# EAGLE design Batboard rev 2.2 (EAGLE 9.0.1)

## Sheet 1 of 4
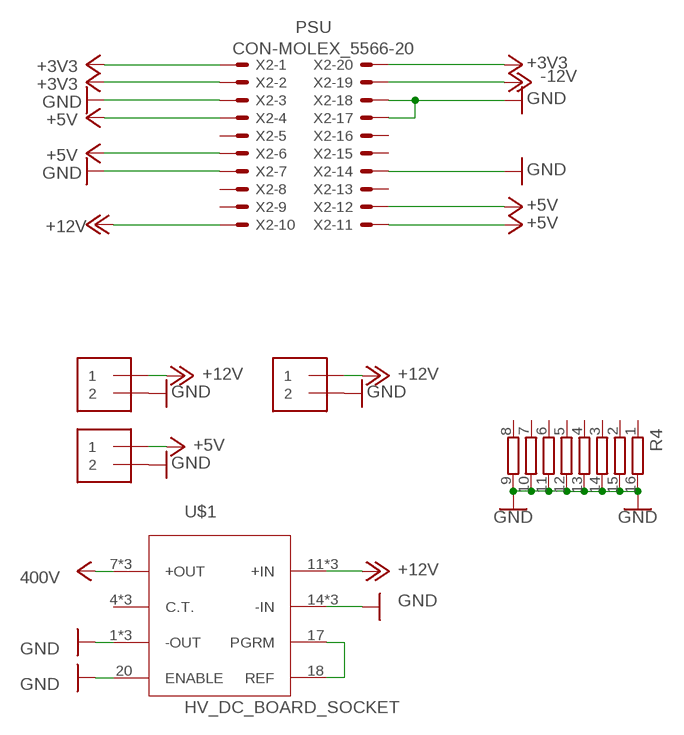
[diagram p0: schematic, sheet 1]

### Parts
J1  1X2-3.5MM  [1X2-3.5MM]
J4  1X2-3.5MM  [1X2-3.5MM]
J6  1X2-3.5MM  [1X2-3.5MM]
R4  4816P-T01  [4816P]
U$1  HV_DC_BOARD_SOCKET  [HV-DC_BOARD_SOCKET]
X2  CON-MOLEX_5566-20  [CON-MOLEX_5566-20]

### Nets
+3V3: X2.1 X2.2 X2.20
+5V: J6.1 X2.4 X2.6 X2.11 X2.12
+12V: J1.1 J4.1 U$1.11(+IN) U$1.12(+IN) U$1.13(+IN) X2.10 ; also sheet 2,4
-12V: X2.19 ; also sheet 2
GND: J1.2 J4.2 J6.2 R4.9 R4.10 R4.11 R4.12 R4.13 R4.14 R4.15 R4.16 U$1.1(-OUT) U$1.2(-OUT) U$1.3(-OUT) U$1.14(-IN) U$1.15(-IN) U$1.16(-IN) U$1.20(ENABLE) X2.3 X2.7 X2.14 X2.17 X2.18 ; also sheet 2,4
N$1: U$1.17(PGRM) U$1.18(REF)
V+: U$1.7(+OUT) U$1.8(+OUT) U$1.9(+OUT) ; supply symbol labelled 400V ; also sheet 2
Unconnected: R4.1 R4.2 R4.3 R4.4 R4.5 R4.6 R4.7 R4.8 U$1.4(C.T.) U$1.5(C.T.) U$1.6(C.T.) X2.5 X2.8 X2.9 X2.13 X2.15 X2.16

### Notes on the sheet
- PSU

## Sheet 2 of 4
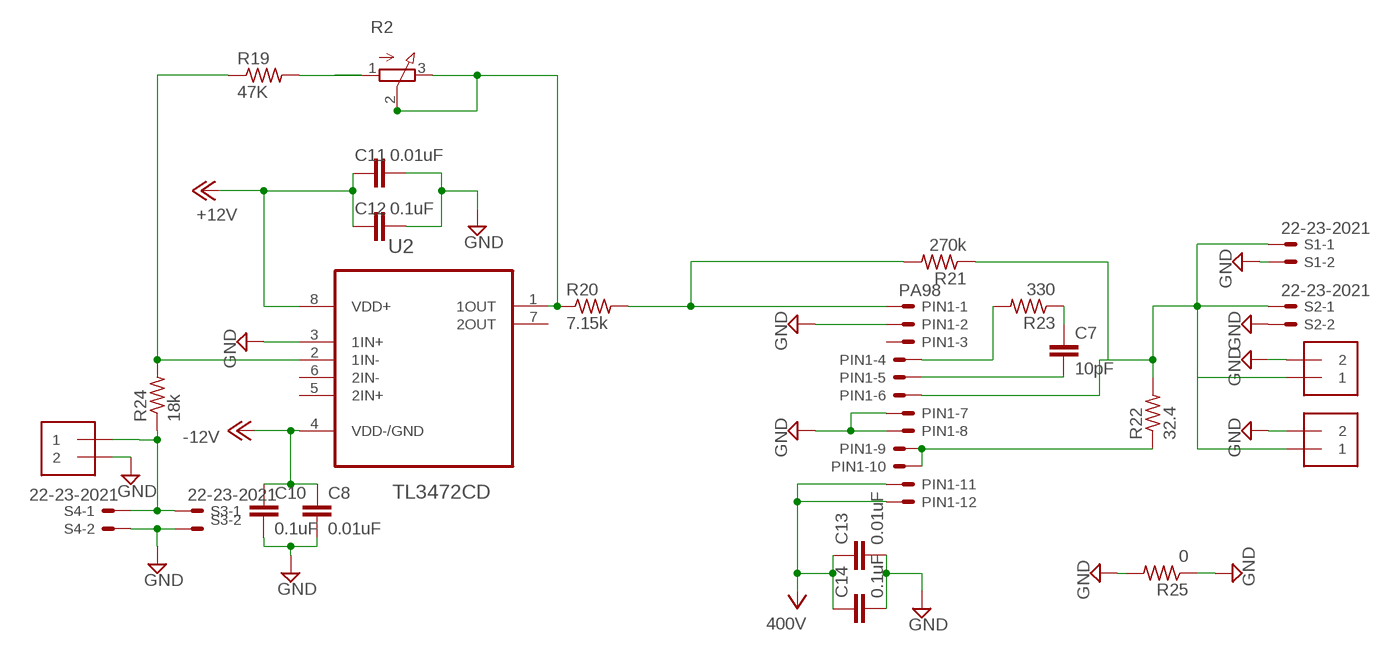
[diagram p1: schematic, sheet 2]

### Parts
C7  10pF  1.0UF-1206-50V-10%  [1206]
C8  0.01uF  1.0UF-1206-50V-10%  [1206]
C10  0.1uF  1.0UF-1206-50V-10%  [1206]
C11  0.01uF  1.0UF-1206-50V-10%  [1206]
C12  0.1uF  1.0UF-1206-50V-10%  [1206]
C13  0.01uF  1.0UF-1206-50V-10%  [1206]
C14  0.1uF  1.0UF-1206-50V-10%  [1206]
J2  1X2-3.5MM  [1X2-3.5MM]
J3  1X2-3.5MM  [1X2-3.5MM]
J5  1X2-3.5MM  [1X2-3.5MM]
PIN1  PA98  22-23-2121  [22-23-2121]
R2  3RP/1610N  [3RP/1610N]
R19  47K  R-US_M1206  [M1206]
R20  7.15k  R-US_M1206  [M1206]
R21  270k  R-US_M1206  [M1206]
R22  32.4  R-US_M1206  [M1206]
R23  330  R-US_M1206  [M1206]
R24  18k  R-US_M1206  [M1206]
R25  0  R-US_M1206  [M1206]
S1  22-23-2021  [22-23-2021]
S2  22-23-2021  [22-23-2021]
S3  22-23-2021  [22-23-2021]
S4  22-23-2021  [22-23-2021]
U2  TL3472CD  [SOIC127P600X175-8N]

### Nets
+12V: C11.1 C12.1 U2.8(VDD+) ; also sheet 1,4
-12V: C8.1 C10.1 U2.4(VDD-/GND) ; also sheet 1
GND: C8.2 C10.2 C11.2 C12.2 C13.2 C14.2 J2.2 J3.2 J5.2 PIN1.2 PIN1.7 PIN1.8 R25.1 R25.2 S1.2 S2.2 S3.2 S4.2 U2.3(1IN+) ; also sheet 1,4
N$4: J5.1 R24.1 S3.1 S4.1
N$10: R19.1 R24.2 U2.2(1IN-)
N$15: R2.2(S) R2.3(E) R20.1 U2.1(1OUT)
N$17: PIN1.1 R20.2 R21.2
N$20: PIN1.9 PIN1.10 R22.1
N$21: PIN1.4 R23.2
N$22: J2.1 J3.1 PIN1.6 R21.1 R22.2 S1.1 S2.1
N$24: R2.1(A) R19.2
N$25: C7.2 PIN1.5
N$26: C7.1 R23.1
V+: C13.1 C14.1 PIN1.11 PIN1.12 ; supply symbol labelled 400V ; also sheet 1
Unconnected: PIN1.3 U2.5(2IN+) U2.6(2IN-) U2.7(2OUT)

## Sheet 3 of 4
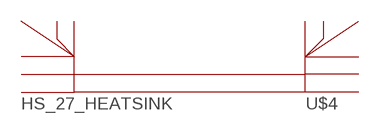
[diagram p2: schematic, sheet 3]

### Parts
U$4  HS_27_HEATSINK  [HS_27_HEATSINK]

## Sheet 4 of 4
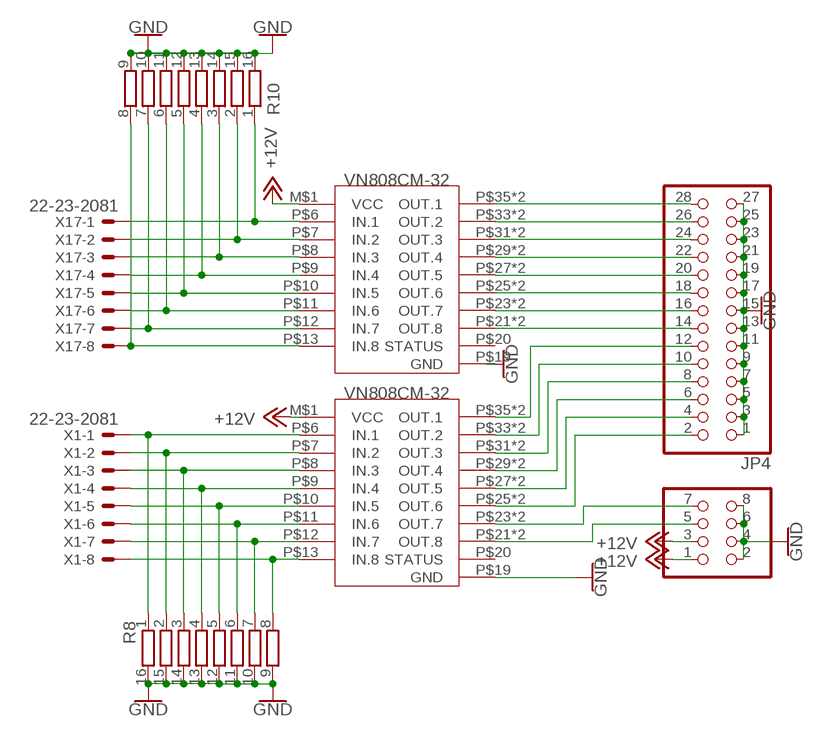
[diagram p3: schematic, sheet 4]

### Parts
JP3  PINHD-2X4  [2X04]
JP4  PINHD-2X14-CB  [2X14-CLEANBIG]
R8  4816P-T01  [4816P]
R10  4816P-T01  [4816P]
U$2  VN808CM-32-E  [PSO36]
U$3  VN808CM-32-E  [PSO36]
X1  22-23-2081  [22-23-2081]
X17  22-23-2081  [22-23-2081]

### Nets
+12V: JP3.1 JP3.3 U$2.M$1(VCC) U$3.M$1(VCC) ; also sheet 1,2
GND: JP3.2 JP3.4 JP3.6 JP3.8 JP4.1 JP4.3 JP4.5 JP4.7 JP4.9 JP4.11 JP4.13 JP4.15 JP4.17 JP4.19 JP4.21 JP4.23 JP4.25 JP4.27 R8.9 R8.10 R8.11 R8.12 R8.13 R8.14 R8.15 R8.16 R10.9 R10.10 R10.11 R10.12 R10.13 R10.14 R10.15 R10.16 U$2.P$19(GND) U$3.P$19(GND) ; also sheet 1,2
N$2: R10.1 U$2.P$6(IN.1) X17.1
N$3: R10.2 U$2.P$7(IN.2) X17.2
N$5: JP4.28 U$2.P$35(OUT.1) U$2.P$36(OUT.1)
N$6: JP4.26 U$2.P$33(OUT.2) U$2.P$34(OUT.2)
N$7: JP4.24 U$2.P$31(OUT.3) U$2.P$32(OUT.3)
N$8: JP4.22 U$2.P$29(OUT.4) U$2.P$30(OUT.4)
N$9: JP4.20 U$2.P$27(OUT.5) U$2.P$28(OUT.5)
N$11: JP4.18 U$2.P$25(OUT.6) U$2.P$26(OUT.6)
N$12: JP4.16 U$2.P$23(OUT.7) U$2.P$24(OUT.7)
N$13: JP4.14 U$2.P$21(OUT.8) U$2.P$22(OUT.8)
N$14: JP4.12 U$3.P$35(OUT.1) U$3.P$36(OUT.1)
N$16: JP4.10 U$3.P$33(OUT.2) U$3.P$34(OUT.2)
N$18: JP4.8 U$3.P$31(OUT.3) U$3.P$32(OUT.3)
N$19: JP4.6 U$3.P$29(OUT.4) U$3.P$30(OUT.4)
N$23: JP4.4 U$3.P$27(OUT.5) U$3.P$28(OUT.5)
N$27: JP4.2 U$3.P$25(OUT.6) U$3.P$26(OUT.6)
N$28: JP3.7 U$3.P$23(OUT.7) U$3.P$24(OUT.7)
N$29: JP3.5 U$3.P$21(OUT.8) U$3.P$22(OUT.8)
N$30: R8.1 U$3.P$6(IN.1) X1.1
N$32: R10.8 U$2.P$13(IN.8) X17.8
N$33: R10.7 U$2.P$12(IN.7) X17.7
N$35: R10.3 U$2.P$8(IN.3) X17.3
N$36: R10.6 U$2.P$11(IN.6) X17.6
N$37: R10.5 U$2.P$10(IN.5) X17.5
N$38: R10.4 U$2.P$9(IN.4) X17.4
N$39: R8.8 U$3.P$13(IN.8) X1.8
N$40: R8.7 U$3.P$12(IN.7) X1.7
N$41: R8.2 U$3.P$7(IN.2) X1.2
N$42: R8.3 U$3.P$8(IN.3) X1.3
N$43: R8.6 U$3.P$11(IN.6) X1.6
N$44: R8.5 U$3.P$10(IN.5) X1.5
N$45: R8.4 U$3.P$9(IN.4) X1.4
Unconnected: U$2.P$20(STATUS) U$3.P$20(STATUS)

## Library data of the parts
C7 = SparkFun-Capacitors:1.0UF: 1µF ceramic capacitors A capacitor is a passive two-terminal electrical component used to store electrical energy temporarily in an electric field.; MF: KEMET; MPN: C0805C479C5GACTU; OC_FARNELL: 1800809; PROD_ID: CAP-09822; VALUE: 1.0uF
C8 C11 C13 = SparkFun-Capacitors:1.0UF: 1µF ceramic capacitors A capacitor is a passive two-terminal electrical component used to store electrical energy temporarily in an electric field.; MF: KEMET; MPN: C0805C103K1RACTU; OC_FARNELL: 1414661; PROD_ID: CAP-09822; VALUE: 1.0uF
C10 C12 C14 = SparkFun-Capacitors:1.0UF: 1µF ceramic capacitors A capacitor is a passive two-terminal electrical component used to store electrical energy temporarily in an electric field.; MF: KEMET; MPN: C0805C104J5RACTU; OC_FARNELL: 1414663; PROD_ID: CAP-09822; VALUE: 1.0uF
J1-J6 = adafruit:1X2: 3.5mm Terminal block http://www.ladyada.net/library/pcb/eaglelibrary.html
JP3 = adafruit:PINHD-2X4: PIN HEADER
JP4 = adafruit:PINHD-2X14: PIN HEADER
PIN1 = con-molex:22-23-2121: .100" (2.54mm) Center Header - 12 Pin; OC_FARNELL: unknown; OC_NEWARK: 56H0456
R2 = pot:3RP/1610N: 16mm Potentiometer one level Source: http://www.alphapotentiometers.net/html/16mm_pot_2.html
R4 R8 R10 = resistor-bourns:4816P-T01: BOURNS RESISTOR NETWORK; MF: BOURNS, INC.; MPN: 4816P-T01-684LF; OC_FARNELL: 9357483; OC_NEWARK: 33K0707
R19 = adafruit:R-US_: RESISTOR, American symbol; MF: KOA SPEAR ELECTRONICS; MPN: SG73S2ATTD9102F; OC_FARNELL: 1400374
R20 = adafruit:R-US_: RESISTOR, American symbol; MF: VISHAY; MPN: CRCW08057K15FKEA; OC_FARNELL: 1152455
R21 = adafruit:R-US_: RESISTOR, American symbol; MF: WELWYN; MPN: WCR0805-270KFI; OC_FARNELL: 1100330RL
R22 R23 R25 = adafruit:R-US_: RESISTOR, American symbol; MF: PANASONIC ELECTRONIC COMPONENTS; MPN: ERJ8ENF32R4V; OC_FARNELL: 2307627
R24 = adafruit:R-US_: RESISTOR, American symbol; MF: WELWYN; MPN: WCR0805-18KFI; OC_FARNELL: 1100322
S1-S4 = con-molex:22-23-2021: .100" (2.54mm) Center Header - 2 Pin; MF: MOLEX; MPN: 22-23-2021; OC_FARNELL: 1462926; OC_NEWARK: 25C3832
U2 = TL3472CD:TL3472CD: HIGH-SLEW-RATE, SINGLE-SUPPLY OPERATIONAL AMPLIFIER; AVAILABILITY: Good; DESCRIPTION: High-Slew- ate, Single-Supply Operational Amplifier 8-SOIC 0 to 70; MF: Texas Instruments; MP: TL3472CD; OC_FARNELL: unknown; PACKAGE: SOIC-8 Texas Instruments; PRICE: 0.47 USD
U$1 = ultravolt_daughterboard:HV_DC_BOARD_SOCKET
U$2 U$3 = powersupplybatbot:VN808CM-32-E
U$4 = ultravolt_daughterboard:HS_27_HEATSINK
X1 X17 = con-molex:22-23-2081: .100" (2.54mm) Center Header - 8 Pin; MF: MOLEX; MPN: 22-23-2081; OC_FARNELL: 1756826; OC_NEWARK: 01C7592
X2 = molex:CON-MOLEX_5566-20: Mini FIT connector 20 pol ATX PC-Motherboard Power connector Source: http://www.molex.com; OC_FARNELL: unknown; OC_NEWARK: unknown

## Board
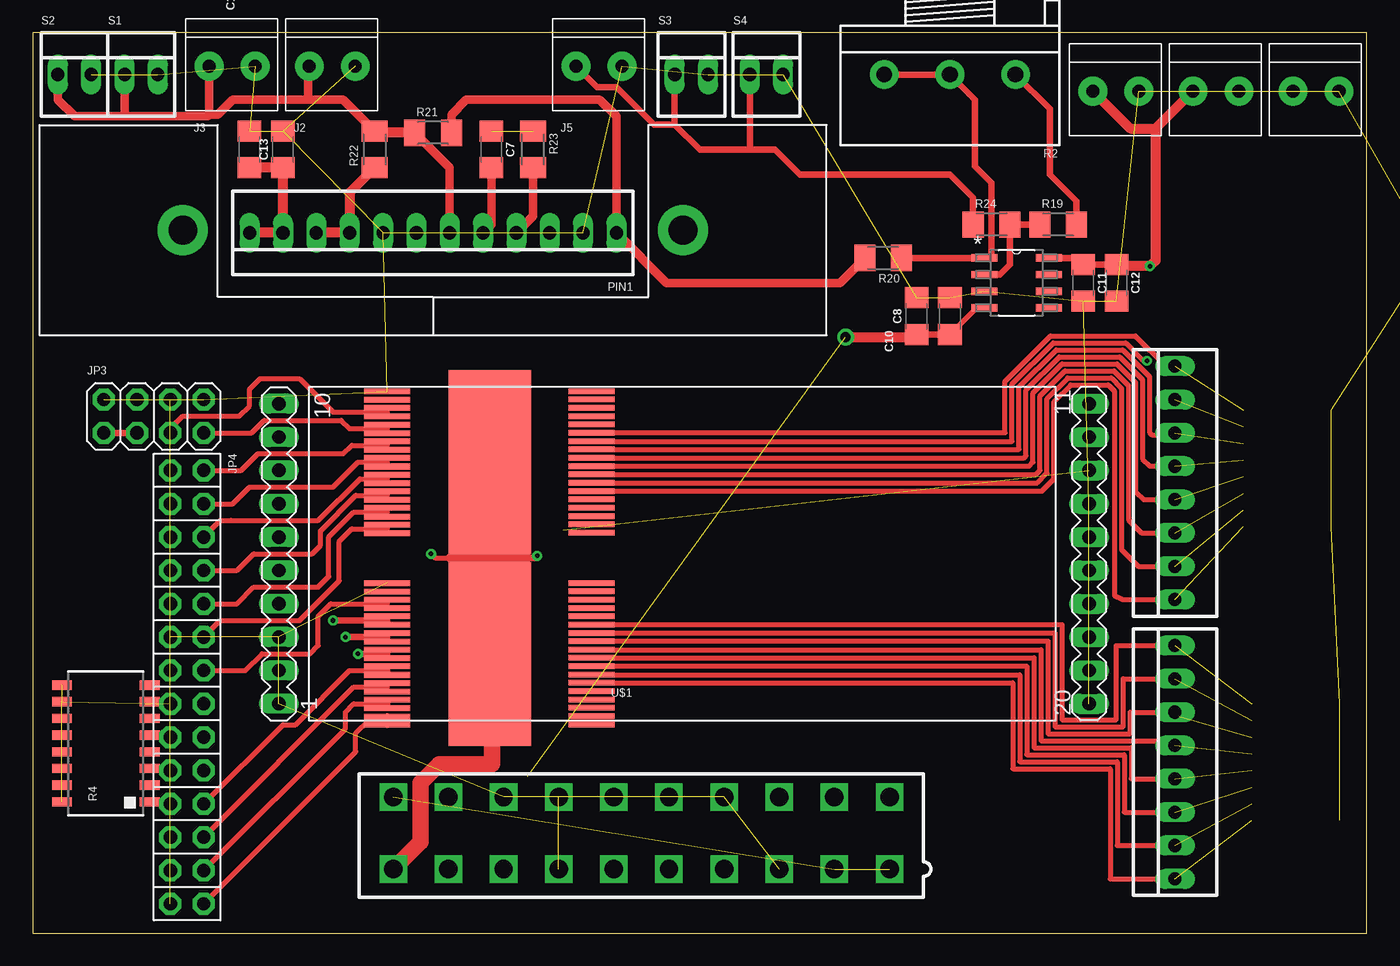
[diagram p4: board, top side]
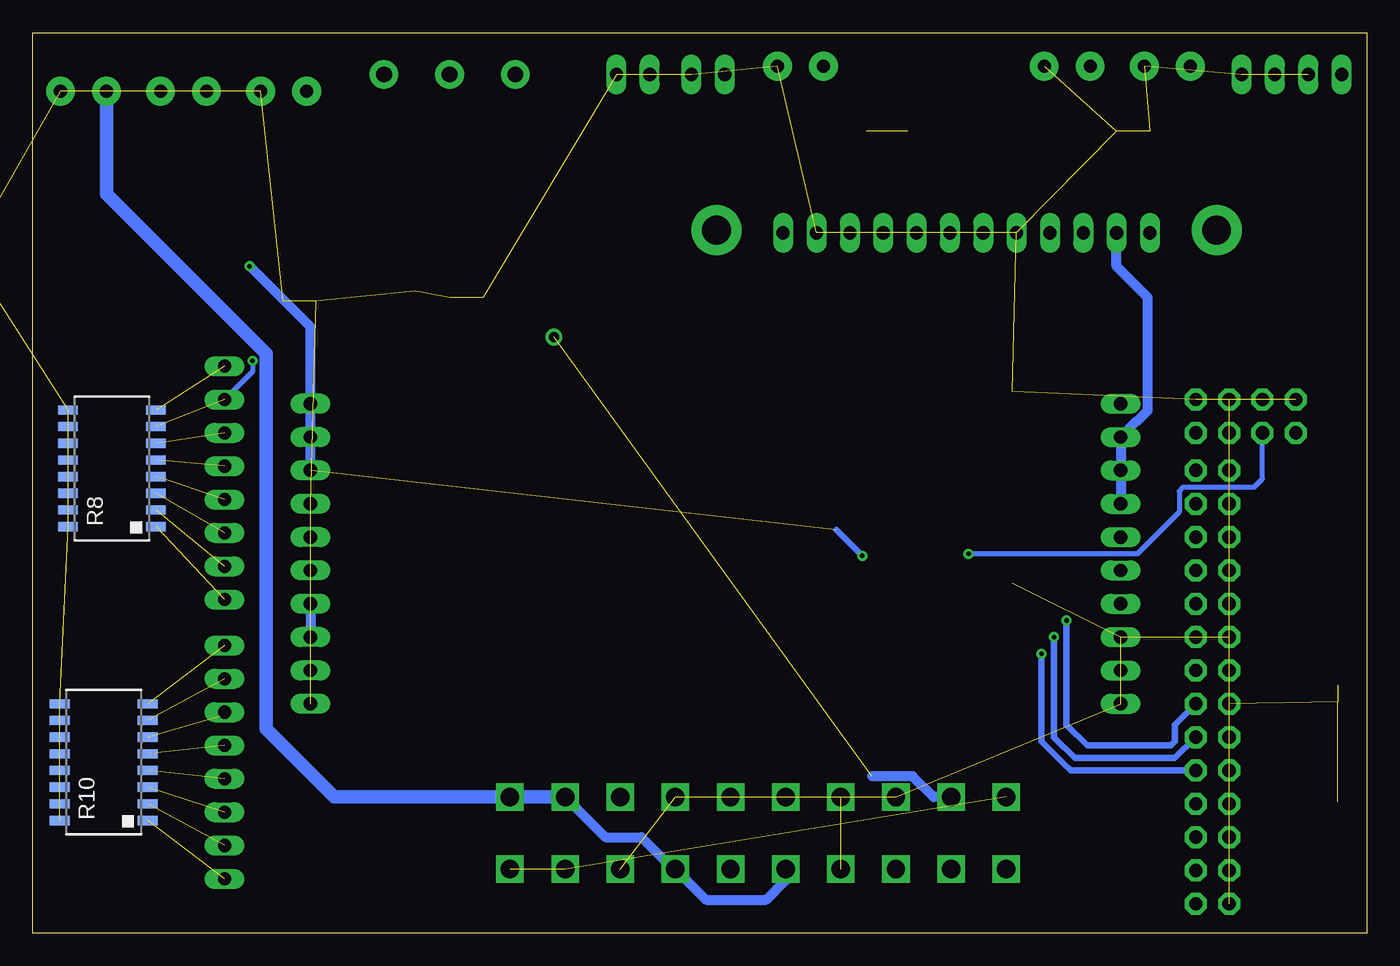
[diagram p5: board, bottom side, seen from below]

Size 101.6 x 68.58 mm. Coordinates in mm from the lower left corner, seen from the top.
Outline: 0,0 101.6,0 101.6,68.58 0,68.58 0,0
Copper layers (1*16): Top 0.035mm / dielectric 1.5mm / Bottom 0.035mm
Design rules "default": minimum track width 6mil, minimum drill 0.35mm, track to track 6mil, track to pad 6mil, pad to pad 6mil, via to via 6mil, smd to smd 6mil, copper to edge 40mil, drill to drill 6mil, minimum pad ring 10mil, minimum via ring 8mil, stop-mask expansion 4mil, vias tented up to drill 0mil, thermal gap 10mil

### Footprints (pad centres in the part's own frame; a part is rotated, then mirrored left to right if it is on the bottom)
1206 = smd 1.6 x 1.8: 1 -1.4,0; 2 1.4,0
1X2-3.5MM = drill 1 pad 2.184: 1 1.8,0; 2 -1.7,0
2X04 = drill 1.016 pad 1.676 octagon: 1 -3.81,-1.27; 2 -3.81,1.27; 3 -1.27,-1.27; 4 -1.27,1.27; 5 1.27,-1.27; 6 1.27,1.27; 7 3.81,-1.27; 8 3.81,1.27
2X14-CLEANBIG = drill 1.016 pad 1.676 octagon: 1 -16.51,-1.27; 2 -16.51,1.27; 3 -13.97,-1.27; 4 -13.97,1.27; 5 -11.43,-1.27; 6 -11.43,1.27; 7 -8.89,-1.27; 8 -8.89,1.27; 9 -6.35,-1.27; 10 -6.35,1.27; 11 -3.81,-1.27; 12 -3.81,1.27; 13 -1.27,-1.27; 14 -1.27,1.27; 15 1.27,-1.27; 16 1.27,1.27; 17 3.81,-1.27; 18 3.81,1.27; 19 6.35,-1.27; 20 6.35,1.27; 21 8.89,-1.27; 22 8.89,1.27; 23 11.43,-1.27; 24 11.43,1.27; 25 13.97,-1.27; 26 13.97,1.27; 27 16.51,-1.27; 28 16.51,1.27
22-23-2121 = drill 1 long: 1 -13.97,0; 2 -11.43,0; 3 -8.89,0; 4 -6.35,0; 5 -3.81,0; 6 -1.27,0; 7 1.27,0; 8 3.81,0; 9 6.35,0; 10 8.89,0; 11 11.43,0; 12 13.97,0
3RP/1610N = drill 1.2 pad 2.184: 1 -5,0; 2 0,0; 3 5,0
4816P = smd 0.7 x 1.5: 1 -4.445,-3.346; 2 -3.175,-3.346; 3 -1.905,-3.346; 4 -0.635,-3.346; 5 0.635,-3.346; 6 1.905,-3.346; 7 3.175,-3.346; 8 4.445,-3.346; 9 4.445,3.346; 10 3.175,3.346; 11 1.905,3.346; 12 0.635,3.346; 13 -0.635,3.346; 14 -1.905,3.346; 15 -3.175,3.346; 16 -4.445,3.346
M1206 = smd 1.6 x 2: 1 -1.4,0; 2 1.4,0
22-23-2021 = drill 1 long: 1 -1.27,0; 2 1.27,0
SOIC127P600X175-8N = smd 1.981 x 0.559: 1 -2.464,1.905; 2 -2.464,0.635; 3 -2.464,-0.635; 4 -2.464,-1.905; 5 2.464,-1.905; 6 2.464,-0.635; 7 2.464,0.635; 8 2.464,1.905
HV-DC_BOARD_SOCKET = drill 1.016 long: 1 -11.43,-13.97; 2 -11.43,-11.43; 3 -11.43,-8.89; 4 -11.43,-6.35; 5 -11.43,-3.81; 6 -11.43,-1.27; 7 -11.43,1.27; 8 -11.43,3.81; 9 -11.43,6.35; 10 -11.43,8.89; 11 50.292,8.89; 12 50.292,6.35; 13 50.292,3.81; 14 50.292,1.27; 15 50.292,-1.27; 16 50.292,-3.81; 17 50.292,-6.35; 18 50.292,-8.89; 19 50.292,-11.43; 20 50.292,-13.97
PSO36 = smd 14 x 6.3: M$1 0.317,0.117 | smd 0.42 x 3.5: P$1 -5.08,-7.618; P$2 -4.43,-7.618; P$3 -3.796,-7.618; P$4 -3.176,-7.618; P$5 -2.526,-7.618; P$6 -1.892,-7.618; P$7 -1.272,-7.618; P$8 -0.622,-7.618; P$9 0.012,-7.618; P$10 0.632,-7.618; P$11 1.282,-7.618; P$12 1.902,-7.618; P$13 2.552,-7.618; P$14 3.186,-7.618; P$15 3.806,-7.618; P$16 4.456,-7.618; P$17 5.09,-7.618; P$18 5.71,-7.618; P$19 5.71,7.931; P$20 5.06,7.931; P$21 4.44,7.931; P$22 3.79,7.931; P$23 3.17,7.931; P$24 2.52,7.931; P$25 1.9,7.931; P$26 1.25,7.931; P$27 0.63,7.931; P$28 -0.02,7.931; P$29 -0.64,7.931; P$30 -1.29,7.931; P$31 -1.91,7.931; P$32 -2.56,7.931; P$33 -3.178,7.931; P$34 -3.828,7.931; P$35 -4.462,7.931; P$36 -5.096,7.931
HS_27_HEATSINK = drill 2.184 pad 3.81: 1 -19.05,6.553; 2 19.05,6.553
22-23-2081 = drill 1 long: 1 -8.89,0; 2 -6.35,0; 3 -3.81,0; 4 -1.27,0; 5 1.27,0; 6 3.81,0; 7 6.35,0; 8 8.89,0
CON-MOLEX_5566-20 = drill 1.4 square: 1 18.9,-2.75; 2 14.7,-2.75; 3 10.5,-2.75; 4 6.3,-2.75; 5 2.1,-2.75; 6 -2.1,-2.75; 7 -6.3,-2.75; 8 -10.5,-2.75; 9 -14.7,-2.75; 10 -18.9,-2.75; 11 18.9,2.75; 12 14.7,2.75; 13 10.5,2.75; 14 6.3,2.75; 15 2.1,2.75; 16 -2.1,2.75; 17 -6.3,2.75; 18 -10.5,2.75; 19 -14.7,2.75; 20 -18.9,2.75

### Placement (x,y rotation side)
C7  34.92,59.69 270 top
C8  67.31,46.99 90 top
C10  69.85,46.99 90 top
C11  80.01,49.53 270 top
C12  82.55,49.53 270 top
C13  19.05,59.69 90 top
C14  16.51,59.69 90 top
J1  90.17,64.14 180 top
J2  22.86,66.04 180 top
J3  15.24,66.04 180 top
J4  82.55,64.14 180 top
J5  43.18,66.04 180 top
J6  97.79,64.14 180 top
JP3  9.21,39.37 0 top
JP4  11.75,18.73 270 top
PIN1  30.48,53.34 180 top
R2  69.85,65.41 180 top
R4  5.56,14.45 90 top
R8  95.57,35.4 90 bottom
R10  96.2,13.02 90 bottom
R19  78.11,53.98 0 top
R20  64.77,51.44 180 top
R21  30.48,60.96 0 top
R22  26.04,59.69 90 top
R23  38.1,59.69 270 top
R24  73.03,53.98 0 top
R25  107.95,51.75 180 top  (outside the outline)
S1  8.26,65.41 0 top
S2  3.17,65.41 0 top
S3  50.16,65.41 0 top
S4  55.88,65.41 0 top
U2  74.93,49.53 0 top
U$1  30.16,31.43 0 top
U$2  34.92,20.95 90 top
U$3  34.92,35.56 90 top
U$4  30.48,46.99 0 top
X1  87,34.29 90 top
X2  46.35,7.62 0 top
X17  87,13.02 90 top

### Tracks (layer width: path | path; a pad name or v marks a point on that pad's centre or on a via)
+3V3  (2 unrouted)
+5V
  Bottom 0.762: X2.12 57.99,7.3 55.24,7.3 52.81,4.87 X2.4 50.33,2.54 45.72,2.54 44.26,4 X2.6
  Bottom 1.016: X2.12 X2.11 78.63,10.37 83.82,15.56 83.82,44.13 95.99,56.3 J6.1
+12V  (via drill 0.35)  (1 unrouted)
  Top 0.381: v30.32,28.89 30.64,28.57 31.75,28.57
  Top 0.508: U2.8 79.5,51.44 C11.1 C12.1 | JP3.3 JP3.1 | 37.62,28.57 38.26,28.57 v38.42,28.73
  Top 0.635: 31.75,28.57 34.81,28.57
  Top 0.762: C12.1 82.68,50.8 v85.09,50.8 85.51,51.22 85.51,61.28 | 34.81,28.57 37.62,28.57 | J4.1 83.61,61.28 85.51,61.28 | 85.51,61.28 J1.1
  Top 1.27: 34.92,21.16 U$2.M$1 | 34.97,23.81 34.97,12.9 34.92,12.86 30.93,12.86 29.53,11.46 29.53,6.94 X2.10
  Top 1.778: 34.92,20.95 34.61,21.27 | 34.29,21.59 34.61,21.27 | 34.61,21.27 U$2.M$1
  Top 2.54: U$3.M$1 34.81,28.57 34.97,23.81 U$2.M$1
  Bottom 0.381: JP3.3 7.94,34.61 8.57,33.97 13.97,33.97 14.29,33.66 14.29,32.07 17.46,28.89 v30.32,28.89
  Bottom 0.508: v38.42,28.73 40.38,30.7
  Bottom 0.762: v85.09,50.8 80.45,46.16 U$1.11 U$1.12 U$1.13
-12V  (via drill 0.76 pad 1.27)  (1 unrouted)
  Top 0.381: C10.1 71.89,47.62 U2.4
  Top 0.508: C10.1 C8.1 66.88,45.16
  Top 0.762: v61.91,45.4 67.12,45.4 C8.1
  Bottom 0.762: X2.19 33,10.37 34.58,11.95 37.67,11.95
GND  (77 unrouted)
N$1
  Bottom 0.762: U$1.17 U$1.18
N$2  (1 unrouted)
  Top 0.381: U$2.P$6 74.65,19.06 74.65,12.52 82.06,12.52 82.06,4.13 X17.1
N$3  (1 unrouted)
  Top 0.381: U$2.P$7 75.18,19.68 75.18,13.06 82.59,13.06 82.59,6.67 X17.2
N$4
  Top 0.508: S3.1 48.9,61.59 | 48.9,61.59 50.8,59.69 54.61,59.69 | 54.61,59.69 56.52,59.69 58.42,57.78 69.85,57.78 71.62,56.01 R24.1 | S4.1 54.61,59.69 | J5.1 42.97,64.45 44.45,64.45 47.31,61.59 48.9,61.59
N$5
  Top 0.381: JP4.28 24.61,13.81 24.61,15.24 25.56,16.19 26.99,16.19
  Top 0.508: U$2.P$35 26.99,16.19 U$2.P$36 | JP4.28
N$6
  Top 0.254: U$2.P$34 26.99,17.46 U$2.P$33
  Top 0.381: JP4.26 23.81,15.56 23.81,16.83 24.45,17.46 26.67,17.46
  Top 0.508: 26.67,17.46 26.99,17.46
N$7
  Top 0.254: U$2.P$32 26.99,18.73 U$2.P$31
  Top 0.381: JP4.24 24.45,18.73 26.99,18.73
N$8
  Top 0.254: U$2.P$30 26.99,20 U$2.P$29
  Top 0.381: JP4.22 19.05,15.88 20,15.88 24.13,20 26.67,20
  Top 0.508: 26.67,20 26.99,20
N$9  (via drill 0.35)
  Top 0.254: U$2.P$28 26.99,21.27 U$2.P$27
  Top 0.508: v24.77,21.27 26.99,21.27
  Bottom 0.508: v24.77,21.27 24.77,14.61 23.1,12.94 22.54,12.38 JP4.20
N$10
  Top 0.508: R19.1 R24.2 74.42,50.93 73.66,50.16 U2.2
N$11  (via drill 0.35)
  Top 0.254: U$2.P$26 26.99,22.54 U$2.P$25
  Top 0.508: v23.81,22.54 26.99,22.54
  Bottom 0.508: JP4.18 14.61,13.34 22.23,13.34 23.81,14.92 v23.81,22.54
N$12  (via drill 0.35)
  Top 0.254: U$2.P$24 26.99,23.81 U$2.P$23
  Top 0.508: v22.86,23.81 26.99,23.81
  Bottom 0.508: JP4.16 14.61,15.88 14.61,14.61 14.92,14.29 21.27,14.29 22.86,15.88 v22.86,23.81
N$13
  Top 0.254: U$2.P$22 26.99,25.08 U$2.P$21
  Top 0.381: JP4.14 16.19,20 17.46,21.27 21.11,21.27 21.75,21.91 21.75,24.13 22.7,25.08 26.99,25.08
N$14
  Top 0.254: U$3.P$36 26.99,30.8 U$3.P$35
  Top 0.381: JP4.12 14.29,23.81 20.32,23.81 23.34,26.83 23.34,29.84 24.29,30.8 26.99,30.8
N$15
  Top 0.508: R20.1 U2.1 73.03,51.44 73.03,57.15 71.75,58.42 71.75,63.5 R2.2 R2.3
N$16
  Top 0.254: U$3.P$34 26.99,32.07 U$3.P$33
  Top 0.381: JP4.10 15.56,25.08 16.83,26.35 21.75,26.35 22.54,27.15 22.54,30.16 24.45,32.07 26.99,32.07
N$17
  Top 0.635: R20.2 61.47,49.53 48.26,49.53 PIN1.1 44.45,62.23 43.18,63.5 33.02,63.5 31.88,62.36 R21.2
N$18
  Top 0.254: U$3.P$32 26.99,33.34 U$3.P$31
  Top 0.381: JP4.8 15.56,27.62 16.83,28.89 21.27,28.89 21.91,29.53 21.91,30.64 24.61,33.34 26.99,33.34
N$19
  Top 0.254: U$3.P$30 26.99,34.61 U$3.P$29
  Top 0.381: JP4.6 14.29,31.43 15.08,31.43 21.75,31.43 24.92,34.61 26.99,34.61
N$20
  Top 0.762: R22.1 24.13,56.38 PIN1.9 PIN1.10
N$21
  Top 0.635: PIN1.4 38.1,54.61 R23.2
N$22
  Top 0.635: R22.2 23.62,63.5 20.95,63.5 | 20.95,63.5 15.24,63.5 14.07,62.34 13.44,62.34 | 13.44,64.67 J3.1 13.44,62.34 | S2.1 1.91,63.5 3.17,62.23 6.99,62.23 | 6.99,62.23 S1.1 | 6.99,62.23 13.34,62.23 13.44,62.34 | J2.1 20.95,65.94 20.95,63.5 | R21.1 31.75,58.29 PIN1.6
  Top 0.762: R22.2 26.16,60.96 R21.1 29.21,60.83
N$23
  Top 0.254: U$3.P$28 26.99,35.88 U$3.P$27
  Top 0.381: JP4.4 15.24,32.7 16.51,33.97 22.86,33.97 24.77,35.88 26.99,35.88
N$24
  Top 0.508: R2.1 77.47,62.78 77.47,57.78 79.5,55.75 R19.2
N$25
  Top 0.635: PIN1.5 34.92,53.98 C7.2
N$26  (1 unrouted)
N$27
  Top 0.254: U$3.P$26 26.99,37.15 U$3.P$25
  Top 0.381: JP4.2 15.88,35.24 17.14,36.51 23.65,36.51 24.29,37.15 26.99,37.15
N$28
  Top 0.254: U$3.P$24 26.99,38.42 U$3.P$23
  Top 0.381: JP3.7 16.67,38.1 17.62,39.05 23.5,39.05 24.13,38.42 26.99,38.42
N$29
  Top 0.254: U$3.P$22 26.99,39.69 U$3.P$21
  Top 0.381: JP3.5 10.48,38.42 11.43,39.37 15.72,39.37 16.51,40.16 16.51,41.43 17.3,42.23 20.32,42.23 22.86,39.69 26.99,39.69
N$30  (1 unrouted)
  Top 0.381: U$3.P$6 76.85,33.67 77.79,34.61 77.79,40.48 79.06,41.75 81.92,41.75 82.39,41.27 82.39,25.72 83.03,25.4 X1.1
N$32  (1 unrouted)
  Top 0.381: U$2.P$13 78.38,23.51 78.38,16.26 82.53,16.26 82.53,21.91 X17.8
N$33  (1 unrouted)
  Top 0.381: U$2.P$12 77.85,22.86 77.85,15.72 83.06,15.72 83.06,19.37 X17.7
N$35  (1 unrouted)
  Top 0.381: U$2.P$8 75.72,20.33 75.72,13.59 83.13,13.59 83.13,9.21 X17.3
N$36  (1 unrouted)
  Top 0.254: 87.31,16.51 X17.6
  Top 0.381: U$2.P$11 77.32,22.24 77.32,15.19 83.59,15.19 83.59,16.83 X17.6
N$37  (1 unrouted)
  Top 0.381: U$2.P$10 76.78,21.59 76.78,14.66 87,14.66 X17.5
N$38  (1 unrouted)
  Top 0.254: 86.36,11.75 X17.4
  Top 0.381: U$2.P$9 76.25,20.97 76.25,14.12 83.66,14.12 83.66,11.75 X17.4
N$39  (1 unrouted)
  Top 0.381: U$3.P$13 74.05,38.11 74.05,42.03 77.51,45.48 83.99,45.48 86.3,43.18 X1.8
N$40  (via drill 0.35)  (1 unrouted)
  Top 0.381: U$3.P$12 74.59,37.46 74.59,41.81 77.73,44.95 83.24,44.95 84.6,43.59 v84.87,43.59
  Bottom 0.381: v84.87,43.59 84.87,42.77 X1.7
N$41  (1 unrouted)
  Top 0.381: U$3.P$7 76.52,34.29 77.25,35.03 77.25,40.7 78.84,42.28 82.14,42.28 82.92,41.5 82.92,29.21 84.19,27.94 X1.2
N$42  (1 unrouted)
  Top 0.381: U$3.P$8 76.41,34.94 76.72,35.25 76.72,40.92 78.62,42.82 82.36,42.82 83.46,41.72 83.46,31.48 84.45,30.48 X1.3
N$43  (1 unrouted)
  Top 0.381: U$3.P$11 75.1,36.84 75.12,36.86 75.12,41.59 77.95,44.42 83.02,44.42 85.06,42.38 85.06,38.13 85.25,37.94 86.84,37.94 X1.6
N$44  (1 unrouted)
  Top 0.381: U$3.P$10 75.49,36.19 75.65,36.35 75.65,41.37 78.17,43.88 82.8,43.88 84.53,42.16 84.53,36.12 85.09,35.56 X1.5
N$45  (1 unrouted)
  Top 0.381: U$3.P$9 75.89,35.57 76.19,35.87 76.19,41.14 78.39,43.35 82.58,43.35 83.99,41.94 83.99,33.64 84.61,33.02 X1.4
V+
  Top 0.762: C14.1 C13.1 PIN1.11 PIN1.12
  Bottom 0.762: PIN1.11 19.05,50.8 16.68,48.42 16.68,39.79 17.43,39.03 17.49,39.03 U$1.9 U$1.8 U$1.7